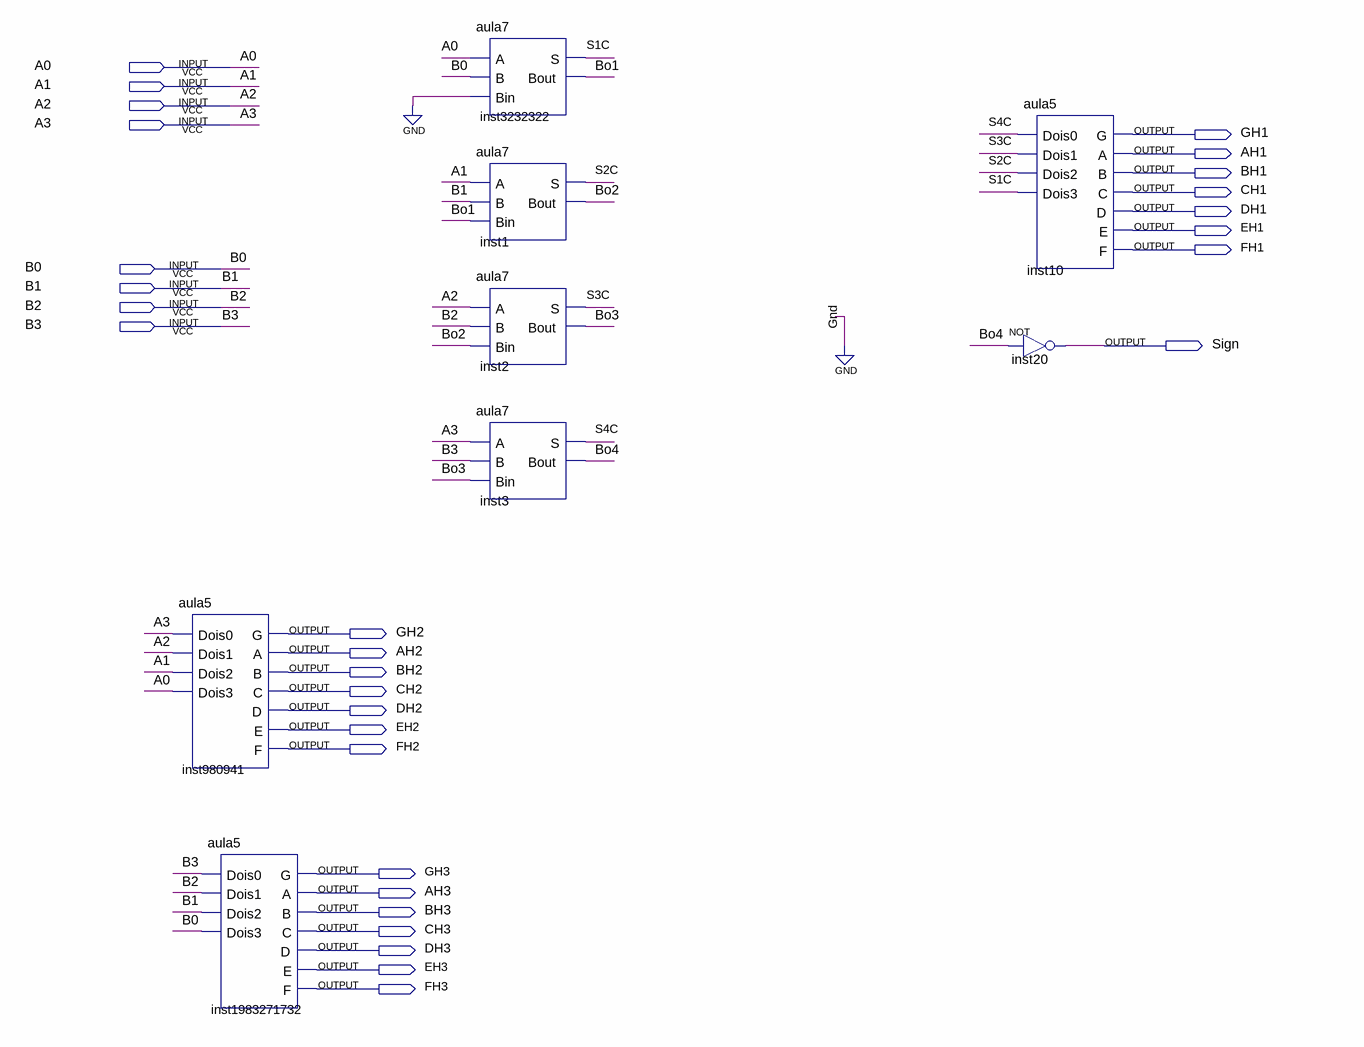
[diagram p0: schematic sheet]
// Quartus schematic aula8.bdf as structural Verilog: 8 symbols, 30 pins
module aula8 (
  input  A0,
  input  A1,
  input  A2,
  input  A3,
  input  B0,
  input  B1,
  input  B2,
  input  B3,
  output GH1,
  output AH1,
  output BH1,
  output CH1,
  output DH1,
  output EH1,
  output FH1,
  output Sign,
  output GH2,
  output AH2,
  output BH2,
  output CH2,
  output DH2,
  output EH2,
  output FH2,
  output GH3,
  output AH3,
  output BH3,
  output CH3,
  output DH3,
  output EH3,
  output FH3
);

  wire Bo1, Bo2, Bo3, Bo4, S1C, S2C, S3C, S4C;

  aula5 inst980941 (
    .Dois0(A3), .Dois1(A2), .Dois2(A1), .Dois3(A0), .G(GH2), .A(AH2), .B(BH2), .C(CH2), .D(DH2), .E(EH2),
    .F(FH2));
  aula5 inst1983271732 (
    .Dois0(B3), .Dois1(B2), .Dois2(B1), .Dois3(B0), .G(GH3), .A(AH3), .B(BH3), .C(CH3), .D(DH3), .E(EH3),
    .F(FH3));
  aula7 inst3232322 (.A(A0), .B(B0), .Bin(1'b0), .S(S1C), .Bout(Bo1));
  aula7 inst1 (.A(A1), .B(B1), .Bin(Bo1), .S(S2C), .Bout(Bo2));
  aula7 inst2 (.A(A2), .B(B2), .Bin(Bo2), .S(S3C), .Bout(Bo3));
  aula7 inst3 (.A(A3), .B(B3), .Bin(Bo3), .S(S4C), .Bout(Bo4));
  aula5 inst10 (
    .Dois0(S4C), .Dois1(S3C), .Dois2(S2C), .Dois3(S1C), .G(GH1), .A(AH1), .B(BH1), .C(CH1), .D(DH1), .E(EH1),
    .F(FH1));
  not inst20 (Sign, Bo4);
endmodule
